# EAGLE design NESverter-R2 (EAGLE 5.12)
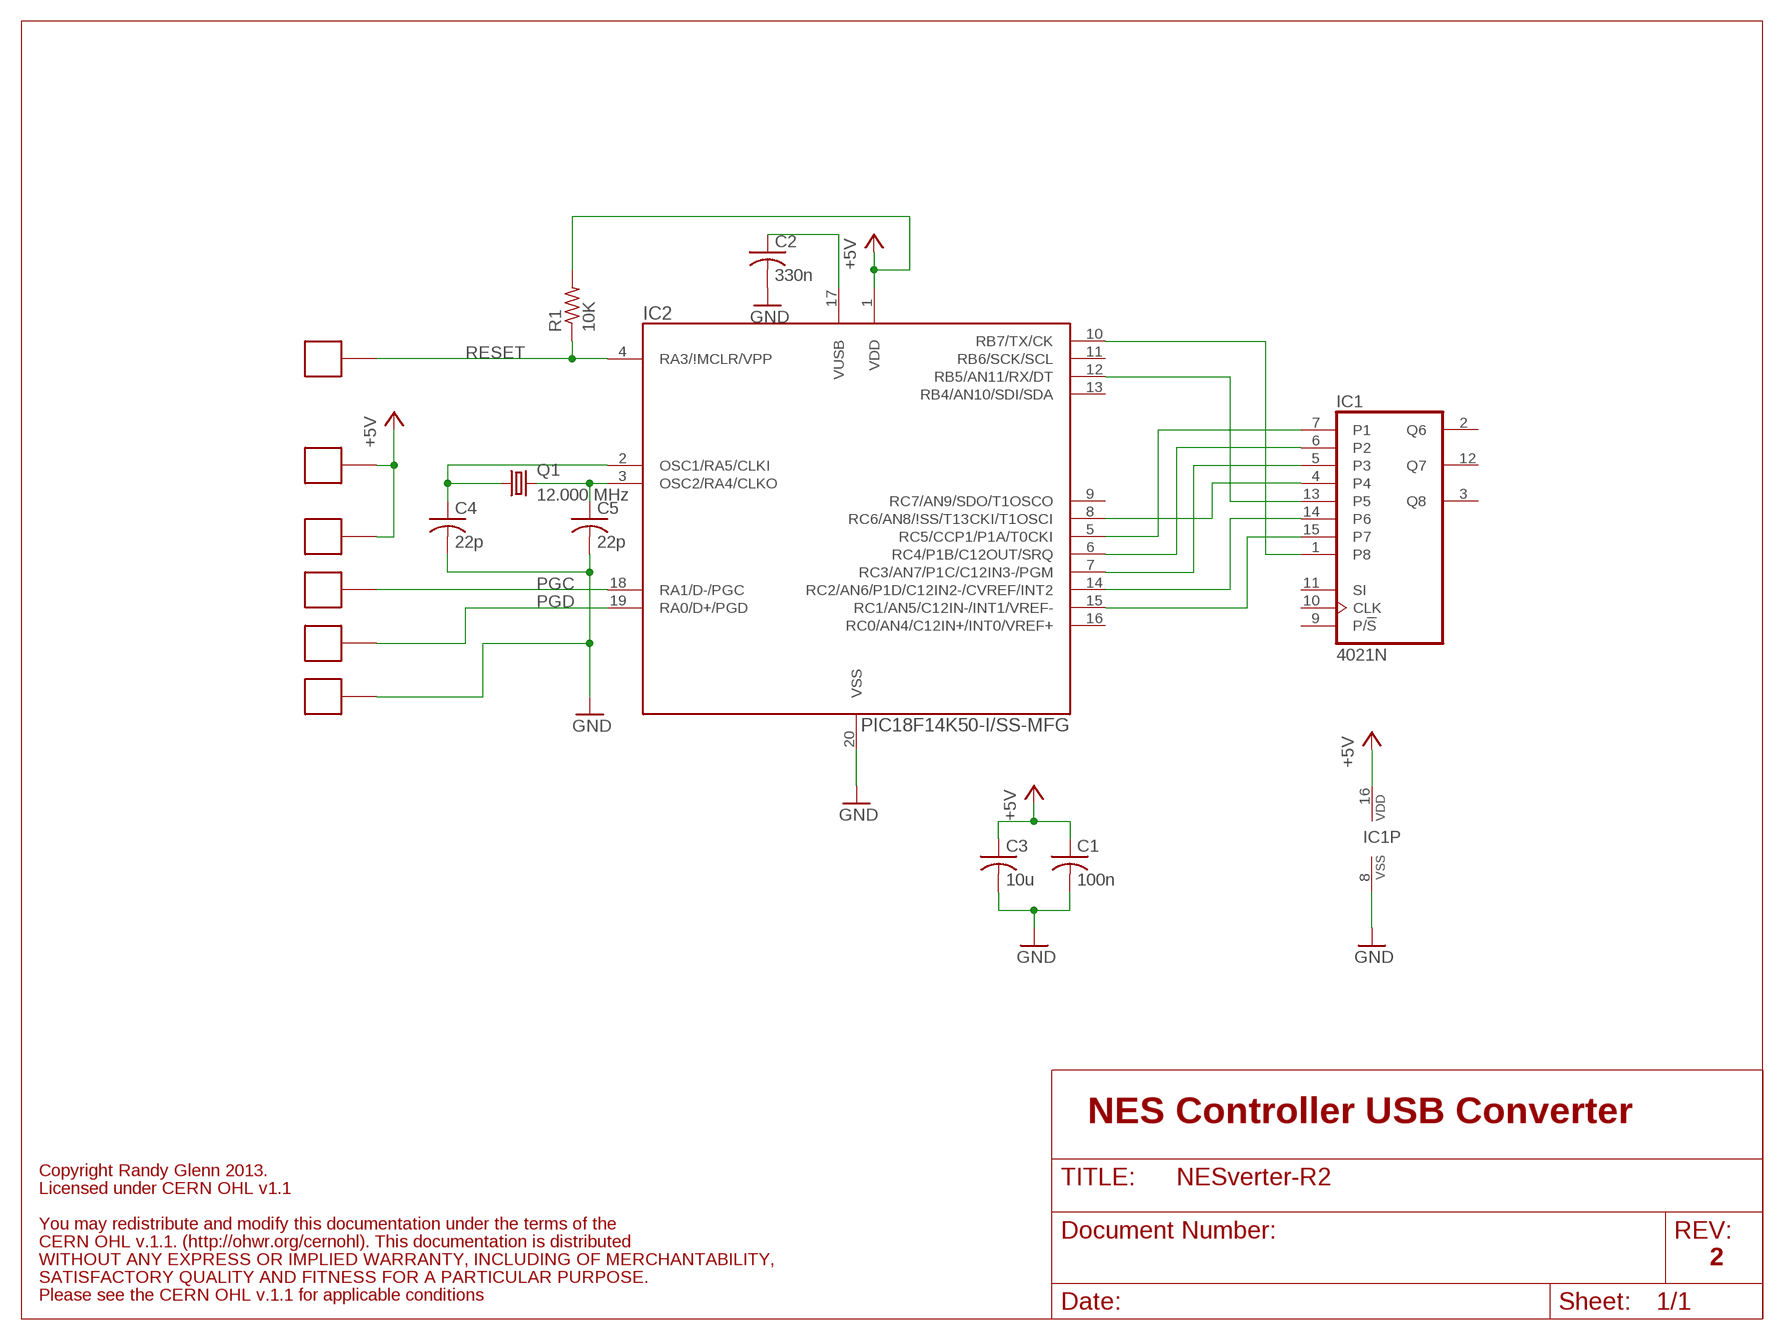
[diagram p0: schematic, sheet 1]

## Parts
C1  100n  C-USC0603  [C0603]
C2  330n  C-USC0603  [C0603]
C3  10u  C-USC0805  [C0805]
C4  22p  C-USC0603  [C0603]
C5  22p  C-USC0603  [C0603]
IC1  4021N  [DIL16]
IC2  PIC18F14K50-I/SS-MFG  [SSOP-20-MFG]
Q1  12.000 MHz  CRYSTALSM49  [SM49]
R1  10K  R-US_R0603  [R0603]
X1  PAD-1.5X3  [PAD-1.5X3]
X2  PAD-2X4  [PAD-2X4]
X3  PAD-2X4  [PAD-2X4]
X4  PAD-2X4  [PAD-2X4]
X5  PAD-2X4  [PAD-2X4]
X6  PAD-1.5X3  [PAD-1.5X3]

## Nets
+5V: C1.1 C3.1 IC1.16(VDD) IC2.1(VDD) R1.2 X1.P$1 X2.P$1
GND: C1.2 C2.2 C3.2 C4.2 C5.2 IC1.8(VSS) IC2.20(VSS) X5.P$1
N$1: C4.1 IC2.2(OSC1/RA5/CLKI) Q1.1
N$2: C5.1 IC2.3(OSC2/RA4/CLKO) Q1.2
N$3: IC1.1(P8) IC2.10(RB7/TX/CK)
N$4: IC1.4 IC2.8(RC6/AN8/\!SS/T13CKI/T1OSCI)
N$5: C2.1 IC2.17(VUSB)
N$6: IC1.7(P1) IC2.5(RC5/CCP1/P1A/T0CKI)
N$7: IC1.6(P2) IC2.6(RC4/P1B/C12OUT/SRQ)
N$8: IC1.5(P3) IC2.7(RC3/AN7/P1C/C12IN3-/PGM)
N$9: IC1.13(P5) IC2.12(RB5/AN11/RX/DT)
N$10: IC1.14(P6) IC2.14(RC2/AN6/P1D/C12IN2-/CVREF/INT2)
N$11: IC1.15(P7) IC2.15(RC1/AN5/C12IN-/INT1/VREF-)
PGC: IC2.18(RA1/D-/PGC) X3.P$1
PGD: IC2.19(RA0/D+/PGD) X4.P$1
RESET: IC2.4(RA3/\!MCLR/VPP) R1.1 X6.P$1
Unconnected: IC1.2(Q6) IC1.3(Q8) IC1.9(P/!S) IC1.10(CLK) IC1.11(SI) IC1.12(Q7) IC2.9(RC7/AN9/SDO/T1OSCO) IC2.11(RB6/SCK/SCL) IC2.13(RB4/AN10/SDI/SDA) IC2.16(RC0/AN4/C12IN+/INT0/VREF+)

## Notes on the sheet
- NES Controller USB Converter
- Copyright Randy Glenn 2013.
- Licensed under CERN OHL v1.1
- You may redistribute and modify this documentation under the terms of the
- CERN OHL v.1.1. (http://ohwr.org/cernohl). This documentation is distributed
- WITHOUT ANY EXPRESS OR IMPLIED WARRANTY, INCLUDING OF MERCHANTABILITY, | 2
- SATISFACTORY QUALITY AND FITNESS FOR A PARTICULAR PURPOSE.
- Please see the CERN OHL v.1.1 for applicable conditions

## Library data of the parts
C1-C5 = rcl:C-US: CAPACITOR, American symbol
IC1 = 40xx:4021: 8-bit static SHIFT REGISTER
IC2 = rbg-microchip-pic18:PIC18F14K50-I
Q1 = crystal:CRYSTAL: CRYSTAL; OC_FARNELL: unknown; OC_NEWARK: unknown
R1 = rcl:R-US_: RESISTOR, American symbol
X1-X6 = rbg-generic-pads:PAD

## Board
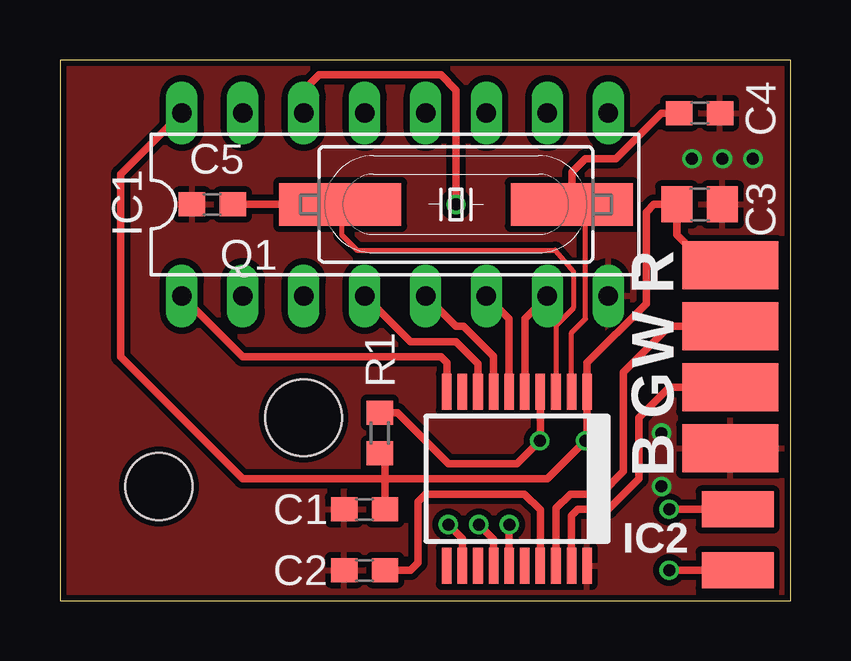
[diagram p1: board, top side]
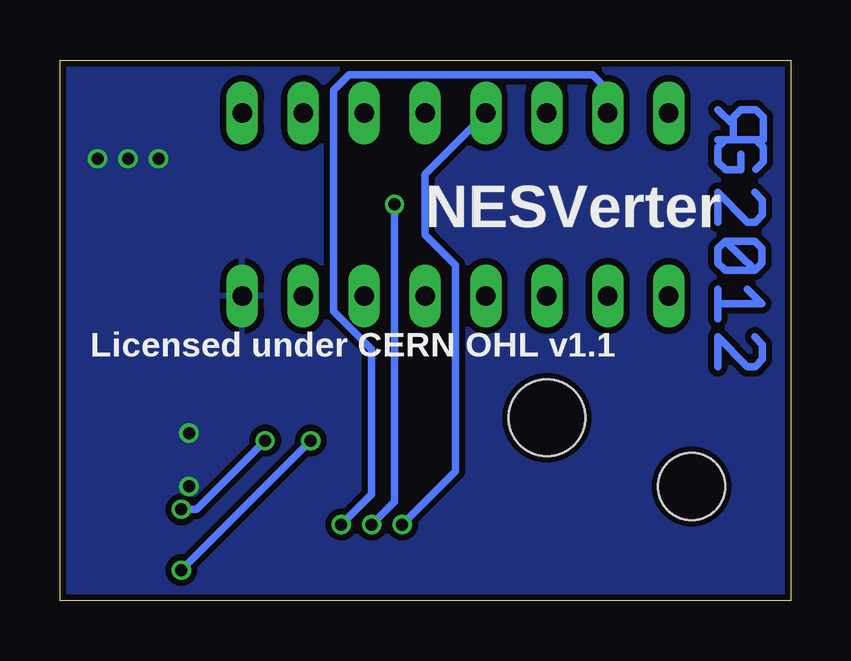
[diagram p2: board, bottom side, seen from below]

Size 30.46 x 22.53 mm. Coordinates in mm from the lower left corner, seen from the top.
Outline: 0,0 30.46,0 30.46,22.53 0,22.53 0,0
Copper layers (1*16): Top 0.035mm / dielectric 1.5mm / Bottom 0.035mm
Design rules "Fusion_eagle_rule_v1.1 *": minimum track width 6mil, minimum drill 12mil, track to track 6mil, track to pad 6mil, pad to pad 6mil, via to via 6mil, smd to smd 0mil, copper to edge 10mil, drill to drill 10mil, minimum pad ring 10mil, minimum via ring 6mil, stop-mask expansion 2mil, vias tented up to drill 100mil, thermal gap 10mil
Holes 3.2 mm at 10.16,7.62
Holes 2.8 mm at 4.13,4.76

### Footprints (pad centres in the part's own frame; a part is rotated, then mirrored left to right if it is on the bottom)
C0603 = smd 1.1 x 1: 1 -0.85,0; 2 0.85,0
C0805 = smd 1.3 x 1.5: 1 -0.95,0; 2 0.95,0
DIL16 = drill 0.813 long: 1 -8.89,-3.81; 2 -6.35,-3.81; 3 -3.81,-3.81; 4 -1.27,-3.81; 5 1.27,-3.81; 6 3.81,-3.81; 7 6.35,-3.81; 8 8.89,-3.81; 9 8.89,3.81; 10 6.35,3.81; 11 3.81,3.81; 12 1.27,3.81; 13 -1.27,3.81; 14 -3.81,3.81; 15 -6.35,3.81; 16 -8.89,3.81
SSOP-20-MFG = smd 0.4 x 1.5: 1 -2.925,-3.625; 2 -2.275,-3.625; 3 -1.625,-3.625; 4 -0.975,-3.625; 5 -0.325,-3.625; 6 0.325,-3.625; 7 0.975,-3.625; 8 1.625,-3.625; 9 2.275,-3.625; 10 2.925,-3.625; 11 2.925,3.625; 12 2.275,3.625; 13 1.625,3.625; 14 0.975,3.625; 15 0.325,3.625; 16 -0.325,3.625; 17 -0.975,3.625; 18 -1.625,3.625; 19 -2.275,3.625; 20 -2.925,3.625
SM49 = smd 5.08 x 1.778: 1 -4.826,0; 2 4.826,0
R0603 = smd 1 x 1.1: 1 -0.85,0; 2 0.85,0
PAD-1.5X3 = smd 3 x 1.5: P$1 0,0
PAD-2X4 = smd 4 x 2: P$1 0,0

### Placement (x,y rotation side)
C1  12.7,3.81 180 top
C2  12.7,1.27 180 top
C3  26.67,16.51 0 top
C4  26.67,20.32 0 top
C5  6.35,16.51 180 top
IC1  13.97,16.51 0 top
IC2  19.05,5.08 180 top
Q1  16.51,16.51 180 top
R1  13.34,6.99 270 top
U$1  [RGLOGO_SMALL_2012]  3.17,19.05 270 bottom
X1  28.26,3.81 0 top
X2  27.94,13.97 0 top
X3  27.94,11.43 0 top
X4  27.94,8.89 0 top
X5  27.94,6.35 0 top
X6  28.26,1.27 180 top

### Tracks (layer width: path | path; a pad name or v marks a point on that pad's centre or on a via)
+5V  (via drill 0.5)
  Top 0.305: X2.P$1 26.99,13.97 25.72,15.24 C3.1 24.77,16.51 24.45,16.19 24.45,12.38 21.98,9.91 IC2.1 21.98,6.74 v21.91,6.67 20.32,5.08 13.55,5.08 | 13.55,5.08 C1.1 | 13.55,5.08 13.55,5.92 R1.2 | v25.4,3.81 X1.P$1 | IC1.16 2.54,17.78 2.54,10.16 7.62,5.08 13.55,5.08
  Bottom 0.305: v21.91,6.67 24.77,3.81 v25.4,3.81
GND  (via drill 0.5)
  other vias: 25.08,6.99 25.08,4.76 27.62,18.41 26.35,18.41 28.89,18.41
  pour Top (isolate 0.254): -0.32,22.86 30.8,22.86 30.8,-0.32 -0.32,-0.32
  pour Bottom (isolate 0.254): -0.32,22.86 30.8,22.86 30.8,-0.32 -0.32,-0.32
N$1
  Top 0.203: IC2.2 21.32,11.16 21.91,11.75 21.91,15.94 Q1.1
  Top 0.305: Q1.1 21.34,17.84 21.91,18.41 23.18,18.41 25.08,20.32 C4.1
N$2
  Top 0.203: IC2.3 20.68,11.47 21.4,12.19 21.4,13.72 20.64,14.61 12.38,14.61 11.75,15.24 11.75,16.45 Q1.2
  Top 0.305: C5.1 Q1.2
N$3
  Top 0.305: IC2.10 16.12,9.91 15.88,10.16 7.62,10.16 IC1.1
N$4
  Top 0.305: IC2.8 17.43,9.88 16.51,10.79 14.61,10.79 IC1.4
N$5
  Top 0.305: IC2.17 20.02,3.79 19.37,4.45 15.24,4.45 14.92,4.13 14.92,1.59 14.61,1.27 C2.1
N$6
  Top 0.305: IC2.5 19.38,11.76 IC1.7
N$7
  Top 0.305: IC2.6 18.73,11.76 IC1.6
N$8
  Top 0.305: IC2.7 18.07,10.18 16.83,11.43 16.51,11.43 IC1.5
N$9  (via drill 0.5)
  Top 0.305: IC2.12 16.77,2.59 v16.19,3.17
  Bottom 0.305: IC1.13 15.24,17.78 15.24,15.24 13.97,13.97 13.97,5.4 v16.19,3.17
N$10  (via drill 0.5)
  Top 0.305: IC1.14 10.16,21.27 10.79,21.91 15.88,21.91 16.51,21.27 v16.51,16.51 | IC2.14 18.07,2.56 v17.46,3.17
  Bottom 0.305: v16.51,16.51 16.51,4.13 v17.46,3.17
N$11  (via drill 0.5)
  Top 0.305: IC2.15 v18.73,3.17
  Bottom 0.305: IC1.15 7.62,21.27 8.26,21.91 18.41,21.91 19.05,21.27 19.05,12.06 17.46,10.48 17.46,4.45 v18.73,3.17
PGC
  Top 0.305: IC2.18 20.68,3.85 21.27,4.45 22.54,4.45 23.5,5.4 23.5,9.53 25.4,11.43 X3.P$1
PGD
  Top 0.305: X4.P$1 25.4,8.89 24.13,7.62 24.13,5.08 22.86,3.81 21.59,3.81 21.32,3.54 IC2.19
RESET  (via drill 0.5)
  Top 0.305: R1.1 14.07,7.83 16.19,5.71 19.05,5.71 v20,6.67 20.02,6.69 IC2.4 | v25.4,1.27 X6.P$1
  Bottom 0.305: v20,6.67 v25.4,1.27

### Text on the board
tPlace: R | W | G | B
bNames: NESVerter | Licensed under CERN OHL v1.1